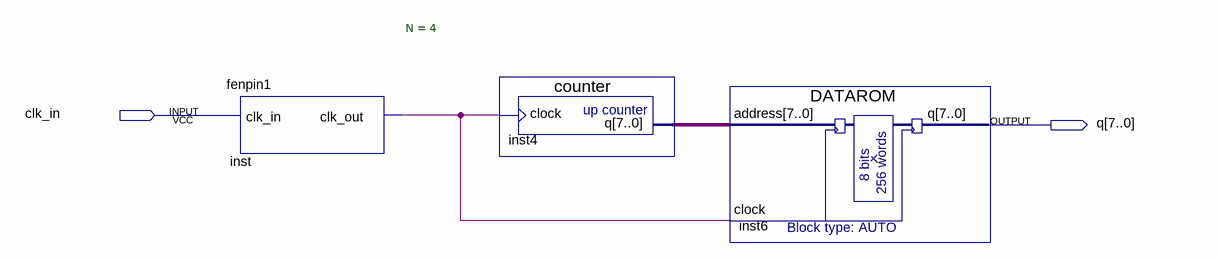
[diagram p0: schematic sheet]
// Quartus schematic Block3.bdf as structural Verilog: 3 symbols, 2 pins
module Block3 (
  input  clk_in,
  output [7:0] q
);

  wire inst_clk_out;
  wire [7:0] inst4_q;

  fenpin1 #(.N(4)) inst (.clk_in(clk_in), .clk_out(inst_clk_out));
  counter inst4 (.clock(inst_clk_out), .q(inst4_q));
  DATAROM inst6 (.address(inst4_q), .clock(inst_clk_out), .q(q));
endmodule
